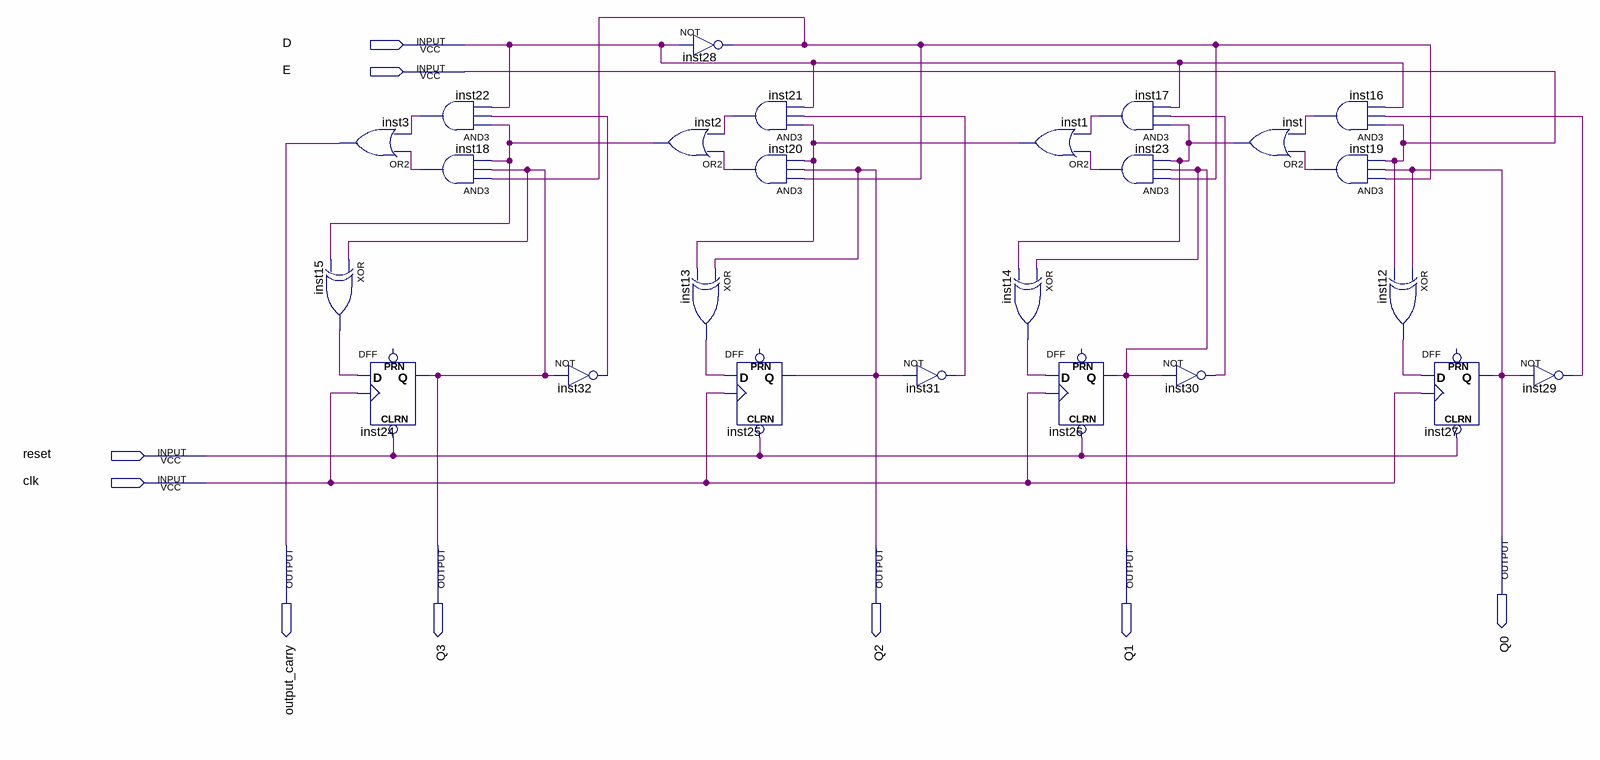
[diagram p0: schematic sheet]
// Quartus schematic COUNTER.bdf as structural Verilog: 25 symbols, 9 pins
module COUNTER (
  input  D,
  input  E,
  input  reset,
  input  clk,
  output Q0,
  output output_carry,
  output Q3,
  output Q2,
  output Q1
);

  wire inst1_out, inst2_out, inst12_out, inst13_out, inst14_out, inst15_out, inst16_out, inst17_out,
       inst18_out, inst19_out, inst20_out, inst21_out, inst22_out, inst23_out, inst28_out, inst29_out,
       inst30_out, inst31_out, inst32_out, inst_out;

  or inst3 (output_carry, inst18_out, inst22_out);
  xor inst15 (inst15_out, Q3, inst2_out);
  DFF inst24 (.CLRN(reset), .CLK(clk), .D(inst15_out), .Q(Q3));  // open: PRN
  and inst22 (inst22_out, inst2_out, inst32_out, D);
  and inst18 (inst18_out, inst28_out, Q3, inst2_out);
  not inst32 (inst32_out, Q3);
  or inst2 (inst2_out, inst20_out, inst21_out);
  not inst28 (inst28_out, D);
  and inst21 (inst21_out, inst1_out, inst31_out, D);
  and inst20 (inst20_out, inst28_out, Q2, inst1_out);
  xor inst13 (inst13_out, Q2, inst1_out);
  DFF inst25 (.CLRN(reset), .CLK(clk), .D(inst13_out), .Q(Q2));  // open: PRN
  not inst31 (inst31_out, Q2);
  or inst1 (inst1_out, inst23_out, inst17_out);
  xor inst14 (inst14_out, Q1, inst_out);
  DFF inst26 (.CLRN(reset), .CLK(clk), .D(inst14_out), .Q(Q1));  // open: PRN
  and inst17 (inst17_out, inst_out, inst30_out, D);
  and inst23 (inst23_out, inst28_out, Q1, inst_out);
  not inst30 (inst30_out, Q1);
  or inst (inst_out, inst19_out, inst16_out);
  and inst16 (inst16_out, E, inst29_out, D);
  and inst19 (inst19_out, inst28_out, Q0, E);
  xor inst12 (inst12_out, Q0, E);
  DFF inst27 (.CLRN(reset), .CLK(clk), .D(inst12_out), .Q(Q0));  // open: PRN
  not inst29 (inst29_out, Q0);
endmodule
